# Altium schematic sheet 2.rs485v4.SchDoc
size A; DocumentNumber: 3; SheetNumber: 3; SheetTotal: 4; PageSetup: Record=PageOptions|CenterHorizontal=True|CenterVertical=True|PrintScale=1.09|XCorrection=1.00|YCorrection=1.00|PrintKind=1|BorderSize=5000000|LeftOffset=0|BottomOffset=0|Orientation=2|PaperLength=1000|PaperWidth=1000|Scale=100|PaperSource=15|PrintQuality=1200|MediaType=1|DitherType=10|PrintScaleMode=1|PaperKind=A4|PaperIndex=9
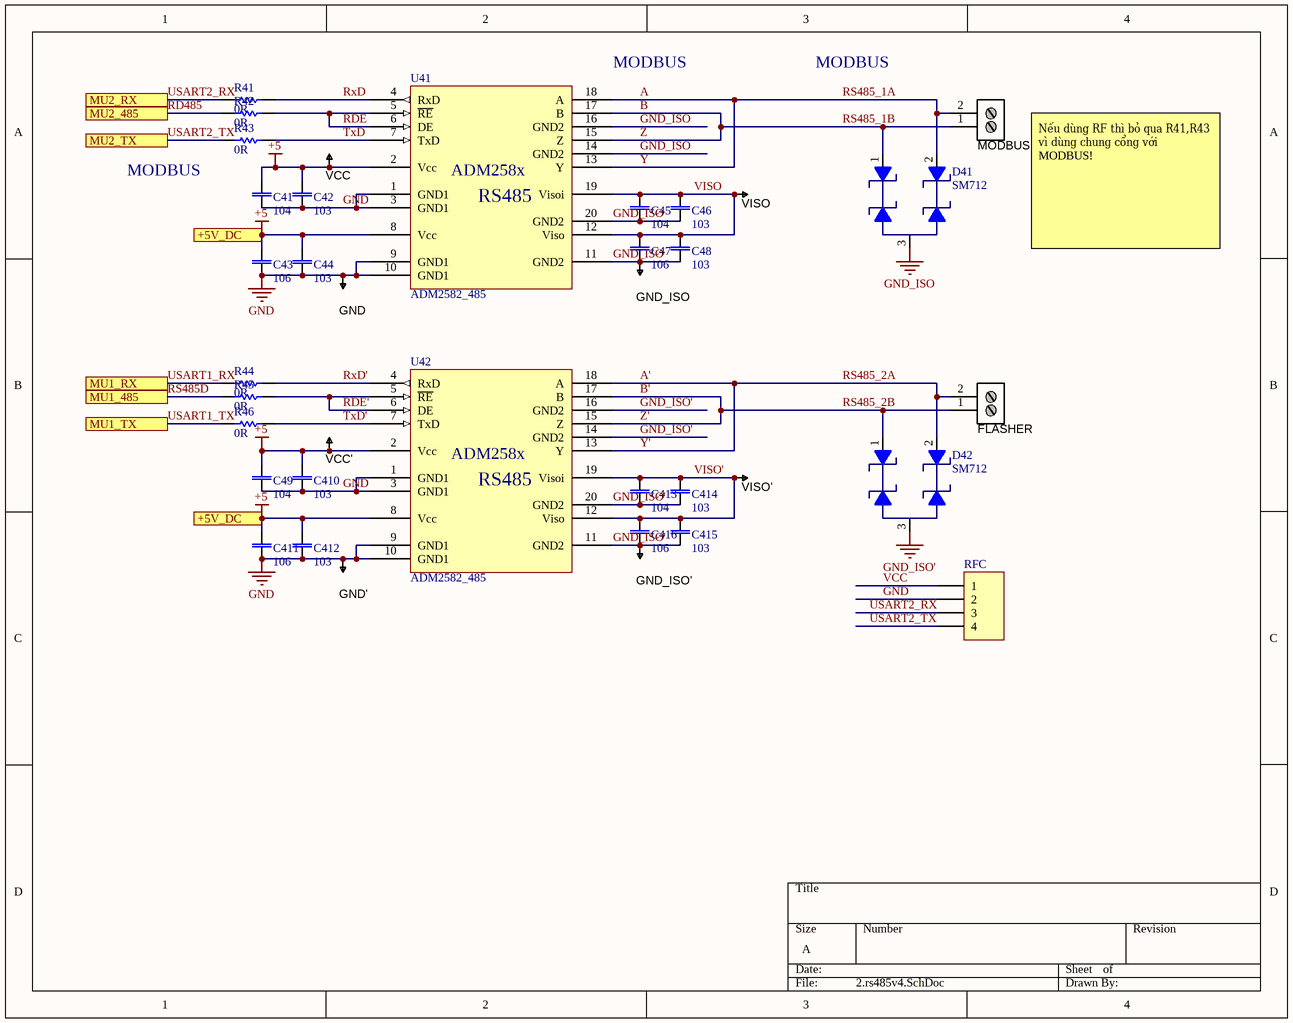
[diagram p0: 2.rs485v4.SchDoc]

## Parts
C41  value 104  [CAP 0805]  (hidden comment: Tụ điện dán 0805104)
C42  value 103  [CAP 0805]  (hidden comment: Tụ điện dán 0805103)
C43  value 106  [CAP 0805]  (hidden comment: Tụ điện dán 0805106)
C44  value 103  [CAP 0805]  (hidden comment: Tụ điện dán 0805103)
C45  value 104  [CAP 0805]  (hidden comment: Tụ điện dán 0805104)
C46  value 103  [CAP 0805]  (hidden comment: Tụ điện dán 0805103)
C47  value 106  [CAP 0805]  (hidden comment: Tụ điện dán 0805106)
C48  value 103  [CAP 0805]  (hidden comment: Tụ điện dán 0805103)
C49  value 104  [CAP 0805]  (hidden comment: Tụ điện dán 0805104)
C410  value 103  [CAP 0805]  (hidden comment: Tụ điện dán 0805103)
C411  value 106  [CAP 0805]  (hidden comment: Tụ điện dán 0805106)
C412  value 103  [CAP 0805]  (hidden comment: Tụ điện dán 0805103)
C413  value 104  [CAP 0805]  (hidden comment: Tụ điện dán 0805104)
C414  value 103  [CAP 0805]  (hidden comment: Tụ điện dán 0805103)
C415  value 103  [CAP 0805]  (hidden comment: Tụ điện dán 0805103)
C416  value 106  [CAP 0805]  (hidden comment: Tụ điện dán 0805106)
D41  SM712  [SOT23 TOP]
D42  SM712  [SOT23 TOP]
FLASHER  Giắc xanh 5.08mm  [2P_PCB1]  (value not drawn)
GND  TESTPOINT  [TP-R60]  (value not drawn)  (no BOM)
GND'  TESTPOINT  [TP-R60]  (value not drawn)  (no BOM)
GND_ISO  TESTPOINT  [TP-R60]  (value not drawn)  (no BOM)
GND_ISO'  TESTPOINT  [TP-R60]  (value not drawn)  (no BOM)
MODBUS  Giắc xanh 5.08mm  [2P_PCB1]  (value not drawn)
R41  value 0R  [RES 0805]  (hidden comment: Điện trở dán 08050R)
R42  value 0R  [RES 0805]  (hidden comment: Điện trở dán 08050R)
R43  value 0R  [RES 0805]  (hidden comment: Điện trở dán 08050R)
R44  value 0R  [RES 0805]  (hidden comment: Điện trở dán 08050R)
R45  value 0R  [RES 0805]  (hidden comment: Điện trở dán 08050R)
R46  value 0R  [RES 0805]  (hidden comment: Điện trở dán 08050R)
RFC  Header 4  [HDR1X4]  (value not drawn)
U41  ADM2582_485  [SO-20B]
U42  ADM2582_485  [SO-20B]
VCC  TESTPOINT  [TP-R60]  (value not drawn)  (no BOM)
VCC'  TESTPOINT  [TP-R60]  (value not drawn)  (no BOM)
VISO  TESTPOINT  [TP-R60]  (value not drawn)  (no BOM)
VISO'  TESTPOINT  [TP-R60]  (value not drawn)  (no BOM)

## Ports
+5V_DC, MU1_485, MU1_RX, MU1_TX, MU2_485, MU2_RX, MU2_TX

## Nets
+5: C41.2 C42.2 C43.2 C44.2 C49.2 C410.2 C411.2 C412.2 U41.2(Vcc) U41.8(Vcc) U42.2(Vcc) U42.8(Vcc) VCC.1 VCC'.1 ; port +5V_DC
GND: C41.1 C42.1 C43.1 C44.1 C49.1 C410.1 C411.1 C412.1 GND.1 GND'.1 RFC.2 U41.1(GND1) U41.3(GND1) U41.9(GND1) U41.10(GND1) U42.1(GND1) U42.3(GND1) U42.9(GND1) U42.10(GND1)
GND_ISO: C45.1 C46.1 C47.1 C48.1 D41.3(GND) GND_ISO.1 U41.11(GND2) U41.14(GND2) U41.16(GND2) U41.20(GND2)
GND_ISO': C413.1 C414.1 C415.1 C416.1 D42.3(GND) GND_ISO'.1 U42.11(GND2) U42.14(GND2) U42.16(GND2) U42.20(GND2)
A: D41.2(IO2) MODBUS.2 U41.13(Y) U41.18(A)  [also labelled RS485_1A, Y]
A': D42.2(IO2) FLASHER.2 U42.13(Y) U42.18(A)  [also labelled RS485_2A, Y']
B: D41.1(IO1) MODBUS.1 U41.15(Z) U41.17(B)  [also labelled RS485_1B, Z]
B': D42.1(IO1) FLASHER.1 U42.15(Z) U42.17(B)  [also labelled RS485_2B, Z']
RD485: R42.1 ; port MU2_485
RDE: R42.2 U41.5(~{RE}) U41.6(DE)
RDE': R45.2 U42.5(~{RE}) U42.6(DE)
RS485D: R45.1 ; port MU1_485
RxD: R41.2 U41.4(RxD)
RxD': R44.2 U42.4(RxD)
TxD: R43.2 U41.7(TxD)
TxD': R46.2 U42.7(TxD)
USART1_RX: R44.1 ; port MU1_RX
USART1_TX: R46.1 ; port MU1_TX
USART2_RX: R41.1 RFC.3 ; port MU2_RX
USART2_TX: R43.1 RFC.4 ; port MU2_TX
VCC: RFC.1
VISO: C45.2 C46.2 C47.2 C48.2 U41.12(Viso) U41.19(Visoi) VISO.1
VISO': C413.2 C414.2 C415.2 C416.2 U42.12(Viso) U42.19(Visoi) VISO'.1

## Notes on the sheet
- (near U41) MODBUS
- MODBUS
- Nếu dùng RF thì bỏ qua R41,R43 vì dùng chung cổng với  MODBUS!
- (in symbol ADM2582_485) ADM258x; RS485

## Library data of the parts
C41-C49 C410-C416 = CAP NP: Capacitor non polarized; cm1: Tụ điện dán 0603; cm3: Tụ điện dán 1206; cm2: Tụ điện dán 0805
D41 D42 = SM712: The SM712 transient voltage suppressor (TVS) diode  is designed for asymmetrical (12V to -7V) protection  in multi-point data transmission standard RS-485  applications.; pin to pad: 2>3 3>2
FLASHER MODBUS = 2P_ScrewTerm_90S_3.81MM: Terminal Block Screw Type THT 2-Position 3.81mm pitch; Manufacturer 1: Tyco Electronics; Manufacturer Part Number 1: 1776113-2; Value: 2 position; Pitch: 0.150" (3.81mm); Positions Per Level: 2; Package / Case: Side Entry; 3.81mm pitch; Category: Connectors Interconnects; Color: Black; Supplier 1: Digi-Key; Supplier Part Number 1: A97976-ND; vl: Giắc xanh 5.08mm
GND GND' GND_ISO GND_ISO' VCC VCC' VISO VISO' = TESTPOINT: SMD test pin
R41-R46 = Res: Resistor; cm1: Điện trở dán 0603; cm2: Điện trở cắm 1/4W; cm4: Điện trở dán 1206; cm3: Điện trở dán 0805
RFC = Header 4: Header, 4-Pin; LatestRevisionDate: 17-Jul-2002; LatestRevisionNote: Re-released for DXP Platform.; Publisher: Altium Limited